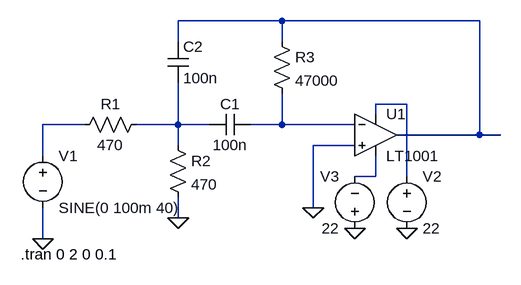
[diagram p0: schematic Rekatirio2.asc]
Rekatirio2.asc, the LTspice schematic file:
Version 4
SHEET 1 1036 680
WIRE 480 -192 320 -192
WIRE 784 -192 480 -192
WIRE 320 -160 320 -192
WIRE 480 -160 480 -192
WIRE 672 -64 624 -64
WIRE 624 -48 624 -64
WIRE 176 -32 112 -32
WIRE 320 -32 320 -96
WIRE 320 -32 256 -32
WIRE 368 -32 320 -32
WIRE 480 -32 480 -80
WIRE 480 -32 432 -32
WIRE 592 -32 480 -32
WIRE 784 -16 784 -192
WIRE 784 -16 656 -16
WIRE 816 -16 784 -16
WIRE 320 0 320 -32
WIRE 592 0 528 0
WIRE 112 16 112 -32
WIRE 624 48 624 16
WIRE 624 48 592 48
WIRE 672 48 672 -64
WIRE 528 96 528 0
WIRE 320 112 320 80
WIRE 112 144 112 96
FLAG 112 144 0
FLAG 320 112 0
FLAG 528 96 0
FLAG 672 128 0
FLAG 592 128 0
SYMBOL res 272 -48 R90
WINDOW 0 0 56 VBottom 2
WINDOW 3 32 56 VTop 2
SYMATTR InstName R1
SYMATTR Value 470
SYMBOL cap 432 -48 R90
WINDOW 0 0 32 VBottom 2
WINDOW 3 32 32 VTop 2
SYMATTR InstName C1
SYMATTR Value 100n
SYMBOL res 304 -16 R0
SYMATTR InstName R2
SYMATTR Value 470
SYMBOL cap 304 -160 R0
SYMATTR InstName C2
SYMATTR Value 100n
SYMBOL res 464 -176 R0
SYMATTR InstName R3
SYMATTR Value 47000
SYMBOL voltage 672 32 R0
WINDOW 123 0 0 Left 0
WINDOW 39 0 0 Left 0
SYMATTR InstName V2
SYMATTR Value 22
SYMBOL voltage 592 144 R180
WINDOW 0 24 96 Left 2
WINDOW 3 24 16 Left 2
WINDOW 123 0 0 Left 0
WINDOW 39 0 0 Left 0
SYMATTR InstName V3
SYMATTR Value 22
SYMBOL voltage 112 0 R0
WINDOW 123 0 0 Left 0
WINDOW 39 0 0 Left 0
SYMATTR InstName V1
SYMATTR Value SINE(0 100m 40)
SYMBOL OpAmps\\LT1001 624 -80 R0
SYMATTR InstName U1
TEXT 78 168 Left 2 !.tran 0 2 0 0.1

The netlist it stands for:
* Rekatirio2.asc
R1 N004 N003 470
C1 N005 N004 100n
R2 N004 0 470
C2 N001 N004 100n
R3 N001 N005 47000
V2 N002 0 22
V3 0 N006 22
V1 N003 0 SINE(0 100m 40)
XU1 0 N005 N002 N006 N001 LT1001  ; pins In+ In- V+ V- OUT
.tran 0 2 0 0.1
.lib LTC.lib
.backanno
.end